# Altium schematic sheet BufferBiasAmp.SchDoc
size A; SheetNumber: 2; SheetTotal: 4
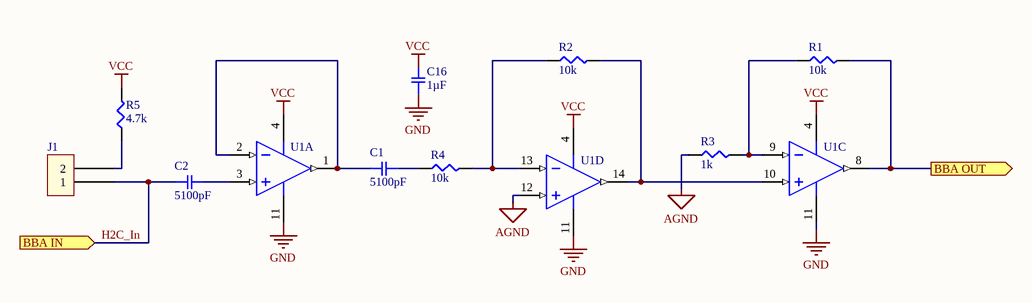
[diagram p0: BufferBiasAmp.SchDoc]

## Parts
C1  5100pF  [SMD-0603C]
C2  5100pF  [SMD-0603C]
C16  1µF  [SMD-0603C]
J1  Header  [1x2 Header]  (value not drawn)
R1  10k  [SMD-0603-RES]
R2  10k  [SMD-0603-RES]
R3  1k  [SMD-0603-RES]
R4  10k  [SMD-0603-RES]
R5  4.7k  [SMD-0603-RES]
U1  OPA1604AIPWR  [PW0014A_N]  (value not drawn)  (parts A,C,D of 4)

## Ports
BBA IN (in), BBA OUT (out)

## Nets
AGND: R3.1 U1.12(IN_D+)
GND: C16.1 U1.11(V-)
VCC: C16.2 R5.2 U1.4(V+)
BBA OUT: R1.2 U1.8(OUT_C) ; port BBA OUT
H2C_In: C2.1 J1.1 ; port BBA IN
NetC1_1: C1.1 R4.1
NetC1_2: C1.2 U1.1(OUT_A) U1.2(IN_A-)
NetC2_2: C2.2 U1.3(IN_A+)
NetJ1_2: J1.2 R5.1
NetR1_1: R1.1 R3.2 U1.9(IN_C-)
NetR2_1: R2.1 R4.2 U1.13(IN_D-)
NetR2_2: R2.2 U1.10(IN_C+) U1.14(OUT_D)

## Library data of the parts
C1 = GRM1887U1H512JA01D: CAP CER 5100PF 50V U2J 0603; Manufacturer: Murata Electronics North America; Value: 5100pF; Operating Temperature: -55°C ~ 125°C; Package / Case: 0603 (1608 Metric); Datasheet Link: https://www.digikey.com/en/products/detail/murata-electronics/GRM1887U1H512JA01D/2612102; Manufacturer Part Number: GRM1887U1H512JA01D
C2 = GRM1887U1H512JA01D: CAP CER 5100PF 50V U2J 0603; Manufacturer: Murata Electronics North America; Factory Stock: 0; Unit Price (USD): 0.2; Minimum Quantity: 1; Tolerance: ±5%; Datasheets: http://www.murata.com/~/media/webrenewal/support/library/catalog/products/capacitor/mlcc/c02e.pdf; Image: //media.digikey.com/Renders/Murata%20Renders/ZRB-SERIES-0402.jpg; Digi-Key Part Number: 490-6399-1-ND; Part Number: GRM1887U1H512JA01D; Quantity Available: 12288; @ qty: 0; Packaging: Cut Tape (CT); Series: GRM; Part Status: Active; Value: 5100pF; Voltage: 50V; Temperature Coefficient: U2J; Operating Temperature: -55°C ~ 125°C; Features: -; Ratings: -; Applications: General Purpose; Mounting Type: Surface Mount, MLCC; Package / Case: 0603 (1608 Metric); Size / Dimension: 0.063" L x 0.031" W (1.60mm x 0.80mm); Height - Seated (Max): -; Thickness (Max): 0.035" (0.90mm); Lead Spacing: -; Lead Style: -
C16 = GCM188R71C105KA64D: CAP CER 1UF 16V X7R 0603; Manufacturer: Samsung Electro-Mechanics; Manufacturer Part Number: CL10A105KA8NNNC; Value: 1µF; Operating Temperature: -55°C ~ 125°C; Package / Case: 0603 (1608 Metric); Datasheet Link: https://www.digikey.com/en/products/detail/samsung-electro-mechanics/CL10A105KA8NNNC/3886760
J1 = 1x2 Header: CONN HEADER VERT 2POS 2.54MM
R1 R2 R4 = ERJ-3EKF1002V: RES SMD 10K OHM 1% 1/10W 0603; Manufacturer: Panasonic Electronic Components; Manufacturer Part Number: RNCP0603FTD10K0; Value: 10k; Operating Temperature: -55°C ~ 155°C; Package / Case: 0603 (1608 Metric); Datasheet Link: https://www.digikey.com/en/products/detail/stackpole-electronics-inc/RNCP0603FTD10K0/2240139
R3 = ERJ-3EKF1001V: RES SMD 1K OHM 1% 1/10W 0603; Manufacturer: Stackpole Electronics Inc; Manufacturer Part Number: RNCP0603FTD1K00; Value: 1k; Operating Temperature: -55°C ~ 155°C; Package / Case: 0603 (1608 Metric); Datasheet Link: https://www.digikey.com/en/products/detail/stackpole-electronics-inc/RNCP0603FTD1K00/2240106
R5 = ERJ-3EKF4701V: RES SMD 4.7K OHM 1% 1/10W 0603; Manufacturer: Panasonic Electronic Components; Value: 4.7k; Operating Temperature: -55°C ~ 155°C; Package / Case: 0603 (1608 Metric); Datasheet Link: https://www.digikey.com/en/products/detail/panasonic-electronic-components/ERJ-3EKF4701V/1746419; Manufacturer Part Number: ERJ-3EKF4701V
U1 = CMP-0272-01731-3: Sound Plus High-Performance, Bipolar-Input Audio Operational Amplifier, 4.5 to 36 V, -40 to 85 degC, 14-pin SOP (PW14), Green (RoHS & no Sb/Br); Manufacturer: Texas Instruments; Datasheet Link: https://www.digikey.com/en/products/detail/texas-instruments/OPA1604AIPWR/2793768; Manufacturer Part Number: OPA1604AIPWR; Operating Temperature: -40°C ~ 85°C; Package / Case: 14-TSSOP